# Altium schematic sheet uSimar_PCB_V0.SchDoc
size A4; DrawnBy: Bruno Oliveira; DocumentNumber: 1; Revision: v0.0; SheetNumber: 1; SheetTotal: 2
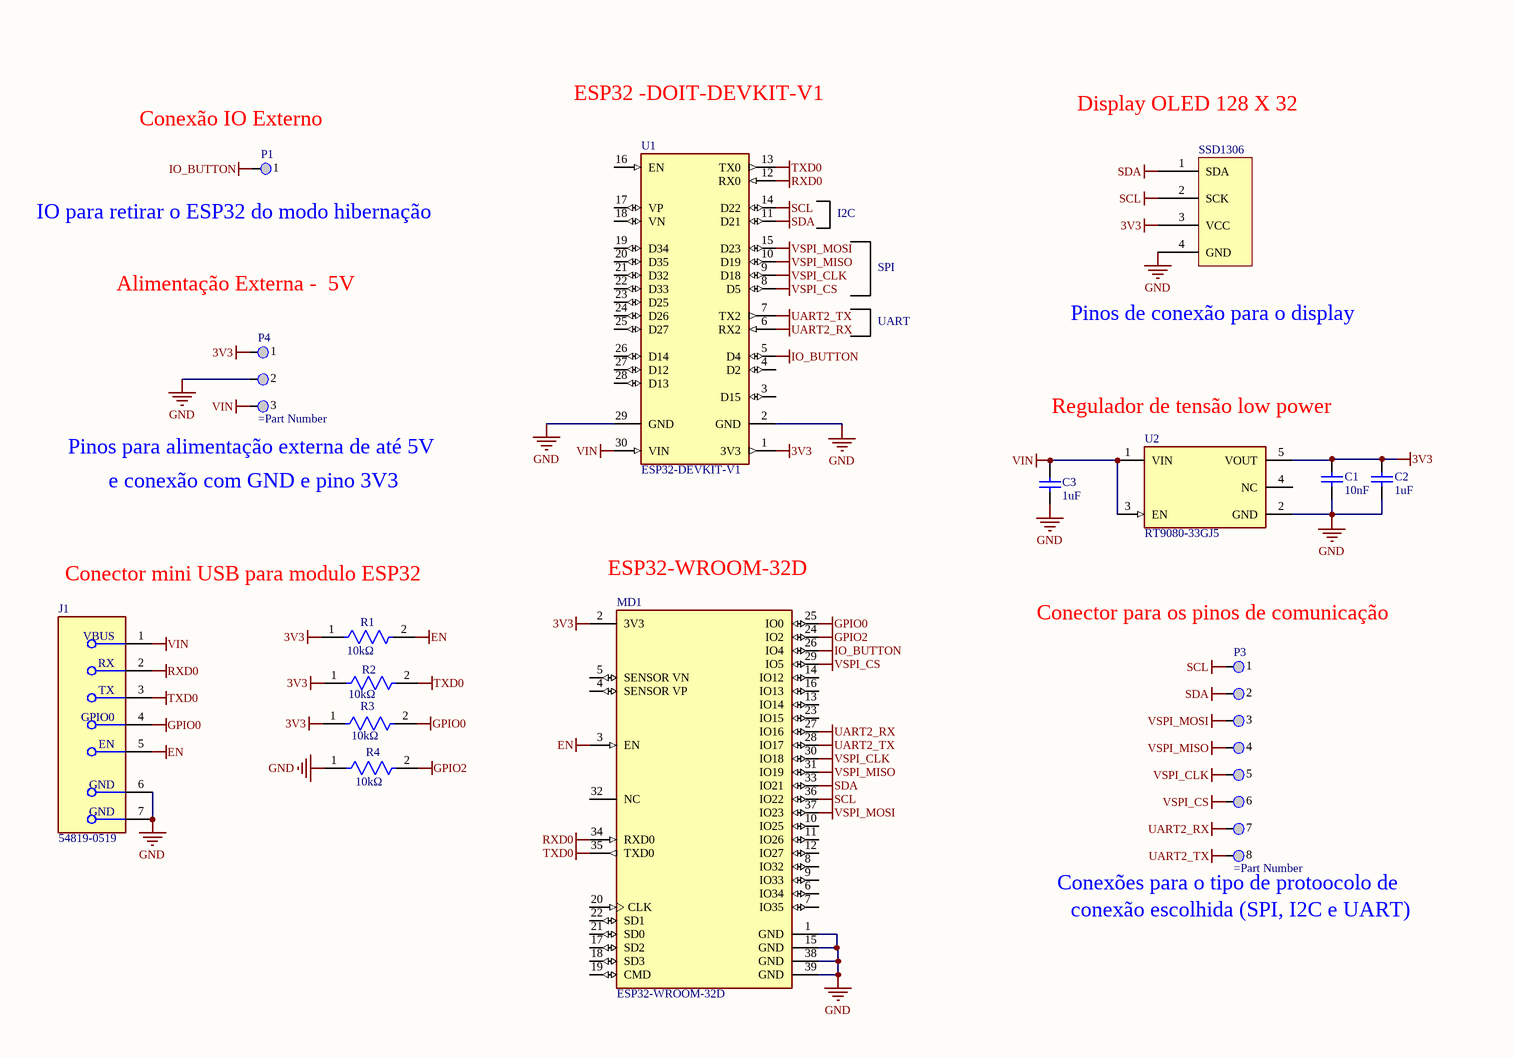
[diagram p0: uSimar_PCB_V0.SchDoc, left]

## Parts
C1  10nF  [C_0805]
C2  1uF  [C_0805]
C3  1uF  [C_0805]
J1  54819-0519  [FP-54819-0519-MFG]
MD1  ESP32-WROOM-32D  [FP-ESP32-WROOM-32D-MFG]
P1  (no value)  [HDR1X1]
P3  (no value)  [HDR1X8]
P4  (no value)  [HDR1X3]
R1  10kΩ  [FP-CRCW0805-e3-IPC_C]
R2  10kΩ  [FP-CRCW0805-e3-IPC_C]
R3  10kΩ  [FP-CRCW0805-e3-IPC_C]
R4  10kΩ  [FP-CRCW0805-e3-IPC_C]
SSD1306  SSD1306  [SSD1306 128X32_wiyhout top opverlay]  (value not drawn)
U1  ESP32-DEVKIT-V1  [MODULE_ESP32_DEVKIT_V1]
U2  RT9080-33GJ5  [FP-RT9080-33GJ5-IPC_B]

## Nets
3V3: C1.2 C2.2 MD1.2(3V3) P4.1 R1.1 R2.1 R3.1 SSD1306.3(VCC) U1.1(3V3) U2.5(VOUT)
EN: J1.5(GND) MD1.3(EN) R1.2
GND: C1.1 C2.1 C3.1 J1.6(MNT_1) J1.7(MNT_2) MD1.1(GND) MD1.15(GND) MD1.38(GND) MD1.39(GND) P4.2 R4.1 SSD1306.4(GND) U1.2(GND) U1.29(GND) U2.2(GND)
GPIO0: J1.4(ID) MD1.25(IO0) R3.2
GPIO2: MD1.24(IO2) R4.2
IO_BUTTON: MD1.26(IO4) P1.1 U1.5(D4)
RXD0: J1.2(RX) MD1.34(RXD0) U1.12(RX0)
SCL: MD1.36(IO22) P3.1 SSD1306.2(SCK) U1.14(D22)
SDA: MD1.33(IO21) P3.2 SSD1306.1(SDA) U1.11(D21)
TXD0: J1.3(D+) MD1.35(TXD0) R2.2 U1.13(TX0)
UART2_RX: MD1.27(IO16) P3.7 U1.6(RX2)
UART2_TX: MD1.28(IO17) P3.8 U1.7(TX2)
VIN: C3.2 J1.1(VBUS) P4.3 U1.30(VIN) U2.1(VIN) U2.3(EN)
VSPI_CLK: MD1.30(IO18) P3.5 U1.9(D18)
VSPI_CS: MD1.29(IO5) P3.6 U1.8(D5)
VSPI_MISO: MD1.31(IO19) P3.4 U1.10(D19)
VSPI_MOSI: MD1.37(IO23) P3.3 U1.15(D23)

Not connected (* = marked no-connect by the designer): MD1 4(SENSOR_VP) 5(SENSOR_VN) 6(IO34) 7(IO35) 8(IO32) 9(IO33) 10(IO25) 11(IO26) 12(IO27) 13(IO14) 14(IO12) 16(IO13) 17(SD2) 18(SD3) 19(CMD) 20(CLK) 21(SD0) 22(SD1) 23(IO15) 32(NC); U1 3(D15) 4(D2) 16(EN) 17(VP) 18(VN) 19(D34) 20(D35) 21(D32) 22(D33) 23(D25) 24(D26) 25(D27) 26(D14) 27(D12) 28(D13); U2 4(NC)

## Notes on the sheet
- (near P1) Conexão IO Externo
- ESP32 -DOIT-DEVKIT-V1
- Display OLED 128 X 32
- (near P1) IO para retirar o ESP32 do modo hibernação
- I2C
- SPI
- Alimentação Externa -  5V
- UART
- (near SSD1306) Pinos de conexão para o display
- (near P4) Pinos para alimentação externa de até 5V
- Regulador de tensão low power
- e conexão com GND e pino 3V3
- Conector mini USB para modulo ESP32
- (near MD1) ESP32-WROOM-32D
- (near P3) Conector para os pinos de comunicação
- (near P3) Conexões para o tipo de protoocolo de
- (near P3) conexão escolhida (SPI, I2C e UART)
- Title:
- Date:
- Project:
- Drawn by:
- Time:
- Revision:
- Sheet
- of
- ENT - AIS - SEI
  Sistemas Eletrônicos e
  Instrumentação
- Copyright CNPEM 2022.
  This documentation describes Open Hardware and is licensed under the CERN OHL S v2. You may redistribute and modify this documentation under the terms of the CERN OHL S v2. (https://www.ohwr.org/cernohl). This documentation is distributed WITHOUT ANY EXPRESS OR IMPLIED WARRANTY, INCLUDING OF MERCHANTABILITY, SATISFACTORY QUALITY AND FITNESS FOR A PARTICULAR PURPOSE. Please see the CERN OHL S v2 for applicable conditions.
- File:
- (in symbol CMP-04767-000009-1) TX; GPIO0; EN

## Library data of the parts
C1 = C0805C103K2RACTU: 0805 C 10nF Ceramic Multilayer Capacitor; 200 VDC; +125degC; X7R Dielec; +/-10%; Manufacturer: KEMET; Tolerance: 10%; Voltage Rating (DC): 200V; Dissipation Factor: 2.5%; Supplier: Rs; Supplier Part Number: 1466276; Manufacturer Part Number: C0805C103K2RACTU; RoHS: Yes; Category: Ceramic Capacitors; Stock: 83475; Pricing: 4000=0,06100 (GBP); Mounting Technology: Surface Mount; Case/Package: 0805; Pins: 2; Case Code (Imperial): 0805; Case Code (Metric): 2012; Dielectric Material: Ceramic; Min Operating Temperature: -55°C; Max Operating Temperature: 125°C; Value: 10nF; Packaging: Tape and Reel; Dielectric: X7R; Termination: SMD/SMT; Voltage Rating: 200V; Package Quantity: 4000; Series: SMD Comm X7R; Voltage: 200V; Construction: Flat; Length: 2mm; Width: 1.2mm; Height: 0.78mm; Depth: 1.25mm; Thickness: 0.035inch; Lead Pitch: 0.75mm; Radiation Hardening: No; RoHS Compliant: Yes; Reach SVHC Compliant: Yes; ComponentLink1URL: https://datasheet.ciiva.com/22700/1851736-22700517.pdf?src-supplier=Element14; ComponentLink1Description: https://datasheet.ciiva.com/22700/1851736-22700517.pdf?src-supplier=Element14; ComponentLink2URL: https://datasheet.ciiva.com/28672/1851736-28672827.pdf?src-supplier=Element14; ComponentLink2Description: https://datasheet.ciiva.com/28672/1851736-28672827.pdf?src-supplier=Element14
C2 C3 = C0805C105K4PACTU: Cap Ceramic 1uF 16V X5R 10% SMD 0805 85C Plastic T/R; Manufacturer: KEMET; Dissipation Factor: 5%; Supplier: Arrow Electronics; Supplier Part Number: C0805C105K4PACTU; Manufacturer Part Number: C0805C105K4PACTU; RoHS: Yes; Category: Ceramic Capacitors; Stock: 30000; Pricing: 2500=0,03220, 5000=0,03190, 10000=0,03150, 25000=0,02930, 30000=0,02810, 50000=0,02590 (USD); Mounting Technology: Surface Mount,PCB; Case/Package: 0805; Case Code (Metric): 2012; Case Code (Imperial): 0805; Dielectric Material: Ceramic; Min Operating Temperature: -55°C; Max Operating Temperature: 85°C; Value: 1uF; Tolerance: 10%; Packaging: Tape and Reel; Voltage Rating: 16V; Package Quantity: 2500; Voltage Rating (DC): 16V; Dielectric: X5R; Termination: SMD/SMT; Voltage: 16V; Series: C0805C; Construction: Flat; Length: 2mm; Width: 1.2mm; Height: 1.25mm; Thickness: 0.055inch; Depth: 1.25mm; Radiation Hardening: No; Reach SVHC Compliant: Yes; RoHS Compliant: Yes; Lead Free: Lead Free; ComponentLink1URL: http://uk.rs-online.com/webdocs/13da/0900766b813daa10.pdf?src-supplier=Rs; ComponentLink1Description: http://uk.rs-online.com/webdocs/13da/0900766b813daa10.pdf?src-supplier=Rs; ComponentLink2URL: http://www.farnell.com/datasheets/2745930.pdf?src-supplier=Farnell; ComponentLink2Description: http://www.farnell.com/datasheets/2745930.pdf?src-supplier=Farnell; ComponentLink3URL: http://uk.rs-online.com/webdocs/13da/0900766b813daa0f.pdf?src-supplier=Rs; ComponentLink3Description: http://uk.rs-online.com/webdocs/13da/0900766b813daa0f.pdf?src-supplier=Rs; ComponentLink4URL: http://components.arrow.com/part/dataview/43037300S8313636N7429?src-supplier=Arrow+Electronics; ComponentLink4Description: http://components.arrow.com/part/dataview/43037300S8313636N7429?src-supplier=Arrow+Electronics; ComponentLink5URL: http://www.farnell.com/datasheets/2745930.pdf?src-supplier=Newark; ComponentLink5Description: http://www.farnell.com/datasheets/2745930.pdf?src-supplier=Newark; ComponentLink6URL: https://search.kemet.com/component-edge/download/datasheet/C0805C105K4PAC.pdf?src-supplier=Allied+Electronics; ComponentLink6Description: https://search.kemet.com/component-edge/download/datasheet/C0805C105K4PAC.pdf?src-supplier=Allied+Electronics; ComponentLink7URL: http://www.farnell.com/datasheets/2745930.pdf?src-supplier=Element14; ComponentLink7Description: http://www.farnell.com/datasheets/2745930.pdf?src-supplier=Element14; ComponentLink8URL: https://www.verical.com/server-webapp/html/getDatasheet?partID=127986&src-supplier=Verical; ComponentLink8Description: https://www.verical.com/server-webapp/html/getDatasheet?partID=127986&src-supplier=Verical; ComponentLink9URL: https://search.kemet.com/component-edge/download/datasheet/C0805C105K4PAC.pdf?src-supplier=Mouser; ComponentLink9Description: https://search.kemet.com/component-edge/download/datasheet/C0805C105K4PAC.pdf?src-supplier=Mouser; ComponentLink10URL: https://api.kemet.com/component-edge/download/datasheet/C0805C105K4PAC.pdf?src-supplier=Digi-Key; ComponentLink10Description: https://api.kemet.com/component-edge/download/datasheet/C0805C105K4PAC.pdf?src-supplier=Digi-Key; ComponentLink11URL: https://search.kemet.com/component-edge/download/datasheet/C0805C105K4PAC.pdf?src-supplier=Avnet; ComponentLink11Description: https://search.kemet.com/component-edge/download/datasheet/C0805C105K4PAC.pdf?src-supplier=Avnet; ComponentLink12URL: http://www.kemet.com/Lists/ProductCatalog/Attachments/19/KEM_C1006_X5R_SMD.pdf?src-supplier=Avnet; ComponentLink12Description: http://www.kemet.com/Lists/ProductCatalog/Attachments/19/KEM_C1006_X5R_SMD.pdf?src-supplier=Avnet; ComponentLink13URL: http://www.farnell.com/datasheets/1824493.pdf?src-supplier=Newark; ComponentLink13Description: http://www.farnell.com/datasheets/1824493.pdf?src-supplier=Newark; ComponentLink14URL: https://search.kemet.com/component-edge/download/datasheet/C0805C105K4PAC.pdf?src-supplier=TTI; ComponentLink14Description: https://search.kemet.com/component-edge/download/datasheet/C0805C105K4PAC.pdf?src-supplier=TTI
J1 = CMP-04767-000009-1: CONN RCPT USB2.0 MINI B 5P R/A; Number of Circuits: 5; Max Current Rating: 1A; Pitch: 0.8mm; Contact Resistance: 50mR; Data Rate: 480Mbps; Gender: Receptacle; Number of Ports: 1; Connector Type: USB; Working Voltage: 30V; Insulation Resistance: 100MR; Number of Rows: 1; Series: 54819; USB Standard: USB 2.0; Contact Plating: Gold; Min Operating Temperature: 0°C; Radiation Hardening: No; Current Rating: 1A; Number of Terminals/Pins: 5; Number of Positions: 5; Packaging: Tray; Termination: Solder; Orientation: Right Angle; Flammability Rating: UL94 V-0; Package Quantity: 3600; Number of Contacts: 5; Lead Free: Lead Free; Max Operating Temperature: 50°C; Color: Black; Housing Color: Black; Contact Material: Copper Alloy; Width: 6.9mm; Length: 7.7mm; Housing Material: Polyamide; Features: Shielded; Mount: Through Hole; Voltage Rating: 30V; Depth: 9mm; Voltage Rating (DC): 30V
MD1 = CMP-194065-000003-1: WIFI MODULE 32MBITS SPI FLASH; Manufacturer: Espressif Systems; Max Supply Voltage: 3.6V; Nominal Supply Current: 500mA; Max Frequency: 2484MHz; Number Of Adc Channels: 16; Number Of Gpio: 32; Interface: I2C,SPI,UART,Ethernet,I2S,Other; Data Rate: 150Mbits/s; Min Supply Voltage: 3V; Bandwidth: 72MHz; Sensitivity: -98dBm; Octopart: https://octopart.com/esp32-wroom-32d-espressif+systems-91040050; Package: ESP32-WROOM-32D; ComponentLink2URL: https://www.espressif.com/sites/default/files/documentation/esp32-wroom-32d_esp32-wroom-32u_datasheet_en.pdf; Lead Free: Yes; Category: UNK; Mouser Description: Wi-Fi/BT BLE Module ESP32-D0WD, SPI Flash, UART, P; Device Class L1: Integrated Circuits (ICs); RoHS: TRUE; Temperature Range Low: -40°C; ComponentLink2Description: Datasheet; Digikey Description: WIFI MODULE 32MBITS SPI FLASH; Height: 3.2mm; Temperature: -40°C to +85°C; Manufacturer Part Number: ESP32-WROOM-32D; Device Class L3: Transceivers; Device Class L2: RF Semiconductors and Devices; Temperature Range High: +85°C; Automotive: No
P1 = Header 1: Header, 1-Pin
P3 = Header 8: Header, 8-Pin
P4 = Header 3: Header, 3-Pin
R1-R4 = CMP-2001-04908-2: RES Thick Film, 10kΩ, 1%, 0.125W, 100ppm/°C, 0805; Resistance: 10kR; Voltage Rating (DC): 150V; Power Rating: 125mW; Weight: 0.000194oz; Package Quantity: 5000; Military Standard: Not; Max Operating Temperature: 155°C; Temperature Coefficient: 100ppm/°C; Contact Plating: Tin; Width: 1.25mm; Height: 0.45mm; Radiation Hardening: No; Tolerance: 1%; Min Operating Temperature: -55°C; Voltage Rating: 150V; Length: 2mm; Depth: 1.25mm; Termination: SMD/SMT; Packaging: Tape and Reel; Case/Package: 0805; Case Code (Metric): 2012; Lead Free: Lead Free; Case Code (Imperial): 0805; Composition: Thick Film
U1 = ESP32-DEVKIT-V1: Dual core, Wi-Fi: 2.4 GHz up to 150 Mbits/s,BLE (Bluetooth Low Energy) and legacy Bluetooth, 32 bits, Up to 240 MHz; MF: Do it; Price: None; Availability: Not in stock; Package: None; MP: ESP32-DEVKIT-V1; Value: *; SnapEDA_Link: https://www.snapeda.com/parts/ESP32-DEVKIT-V1/Do+it/view-part/?ref=snap; Check_prices: https://www.snapeda.com/parts/ESP32-DEVKIT-V1/Do+it/view-part/?ref=eda
U2 = CMP-79890-000003-1: IC REG LIN 3.3V 600MA TSOT23-5; Power Supply Rejection Ratio (PSRR): 75dB; Output Type: Fixed; Max Input Voltage: 5.5V; Dropout Voltage: 530mV; Output Configuration: Positive; Quiescent Current: 4uA; Number of Regulators: 1; Packaging: Cut Tape; RoHS Compliant: Yes; Mount: Surface Mount; Max Operating Temperature: 85°C; Min Output Voltage: 3.3V; Output Current: 600mA; Min Operating Temperature: -40°C; Case/Package: SOT-23-5